# Altium schematic sheet Capacitive_touch.SchDoc
size 381 x 228 mm; SheetNumber: 4; SheetTotal: 8
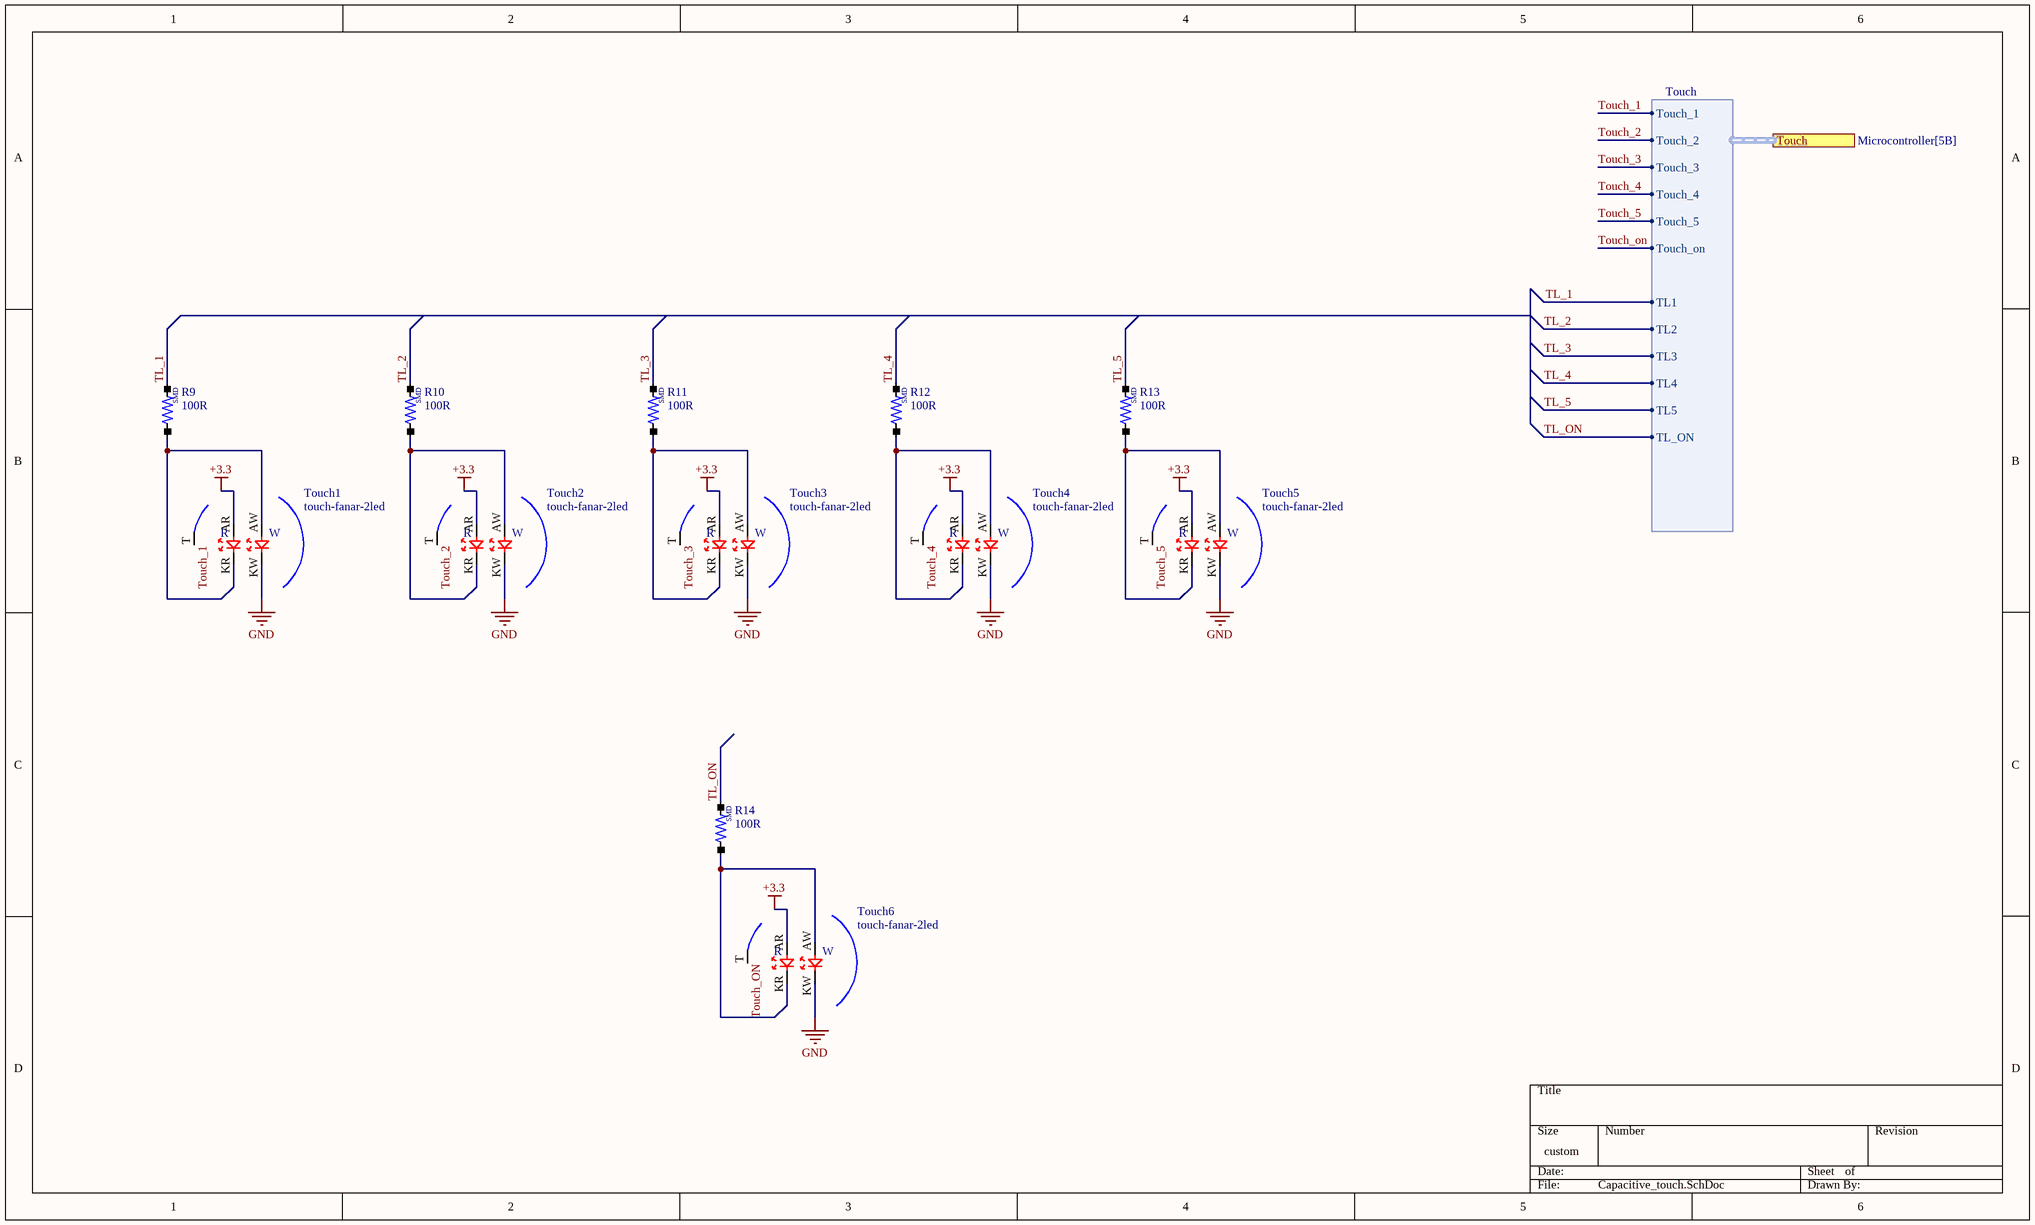
[diagram p0: Capacitive_touch.SchDoc]

## Parts
R9  100R  [RES/0603]
R10  100R  [RES/0603]
R11  100R  [RES/0603]
R12  100R  [RES/0603]
R13  100R  [RES/0603]
R14  100R  [RES/0603]
Touch1  touch-fanar-2led  [fanar-touch-2led]
Touch2  touch-fanar-2led  [fanar-touch-2led]
Touch3  touch-fanar-2led  [fanar-touch-2led]
Touch4  touch-fanar-2led  [fanar-touch-2led]
Touch5  touch-fanar-2led  [fanar-touch-2led]
Touch6  touch-fanar-2led  [fanar-touch-2led]

## Ports
Touch (harness Touch, see Microcontroller[5B])

## Harnesses
Touch: Touch_1, Touch_2, Touch_3, Touch_4, Touch_5, Touch_on, TL1, TL2, TL3, TL4, TL5, TL_ON

## Nets
+3.3: Touch1.AR Touch2.AR Touch3.AR Touch4.AR Touch5.AR Touch6.AR
GND: Touch1.KW Touch2.KW Touch3.KW Touch4.KW Touch5.KW Touch6.KW
TL_1: R9.2 ; port Touch.TL1
TL_2: R10.2 ; port Touch.TL2
TL_3: R11.2 ; port Touch.TL3
TL_4: R12.2 ; port Touch.TL4
TL_5: R13.2 ; port Touch.TL5
TL_ON: R14.2 ; port Touch.TL_ON
Touch_1: Touch1.T ; port Touch.Touch_1
Touch_2: Touch2.T ; port Touch.Touch_2
Touch_3: Touch3.T ; port Touch.Touch_3
Touch_4: Touch4.T ; port Touch.Touch_4
Touch_5: Touch5.T ; port Touch.Touch_5
Touch_ON: Touch6.T ; port Touch.Touch_on
NetR9_1: R9.1 Touch1.AW Touch1.KR
NetR10_1: R10.1 Touch2.AW Touch2.KR
NetR11_1: R11.1 Touch3.AW Touch3.KR
NetR12_1: R12.1 Touch4.AW Touch4.KR
NetR13_1: R13.1 Touch5.AW Touch5.KR
NetR14_1: R14.1 Touch6.AW Touch6.KR

## Notes on the sheet
- (in symbol RES/SMD) SMD
- (in symbol touch-fanar-2led) R; W

## Library data of the parts
R9-R14 = RES/SMD